# EAGLE schematic keypad (EAGLE 6.5.0)
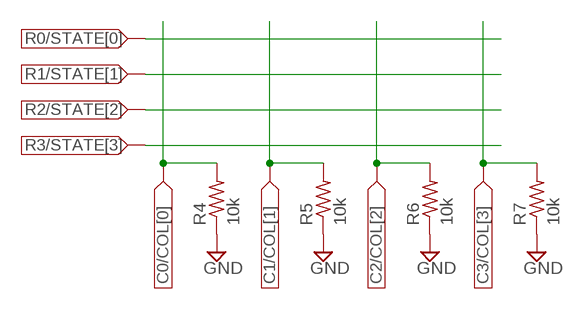
[diagram p0: schematic, sheet 1]

## Parts
C0/COL[0]  R0  V-->  (no package)
C1/COL[1]  R0  V-->  (no package)
C2/COL[2]  R0  V-->  (no package)
C3/COL[3]  R0  V-->  (no package)
R0/STATE[0]  R0  V-->  (no package)
R1/STATE[1]  R0  V-->  (no package)
R2/STATE[2]  R0  V-->  (no package)
R3/STATE[3]  R0  V-->  (no package)
R4  10k  R-US_0207/10  [0207/10]
R5  10k  R-US_0207/10  [0207/10]
R6  10k  R-US_0207/10  [0207/10]
R7  10k  R-US_0207/10  [0207/10]

## Nets
GND: R4.1 R5.1 R6.1 R7.1
N$1: R0/STATE[0].P$1
N$2: R1/STATE[1].P$1
N$3: R2/STATE[2].P$1
N$4: R3/STATE[3].P$1
N$5: C0/COL[0].P$1 R4.2
N$6: C1/COL[1].P$1 R5.2
N$7: C2/COL[2].P$1 R6.2
N$8: C3/COL[3].P$1 R7.2

## Library data of the parts
C0/COL[0] C1/COL[1] C2/COL[2] C3/COL[3] R0/STATE[0] R1/STATE[1] R2/STATE[2] R3/STATE[3] = sherman:V-->: SUPPLY SYMBOL
R4-R7 = resistor:R-US_: RESISTOR, American symbol